# EAGLE design bbps5 (EAGLE 5.11)
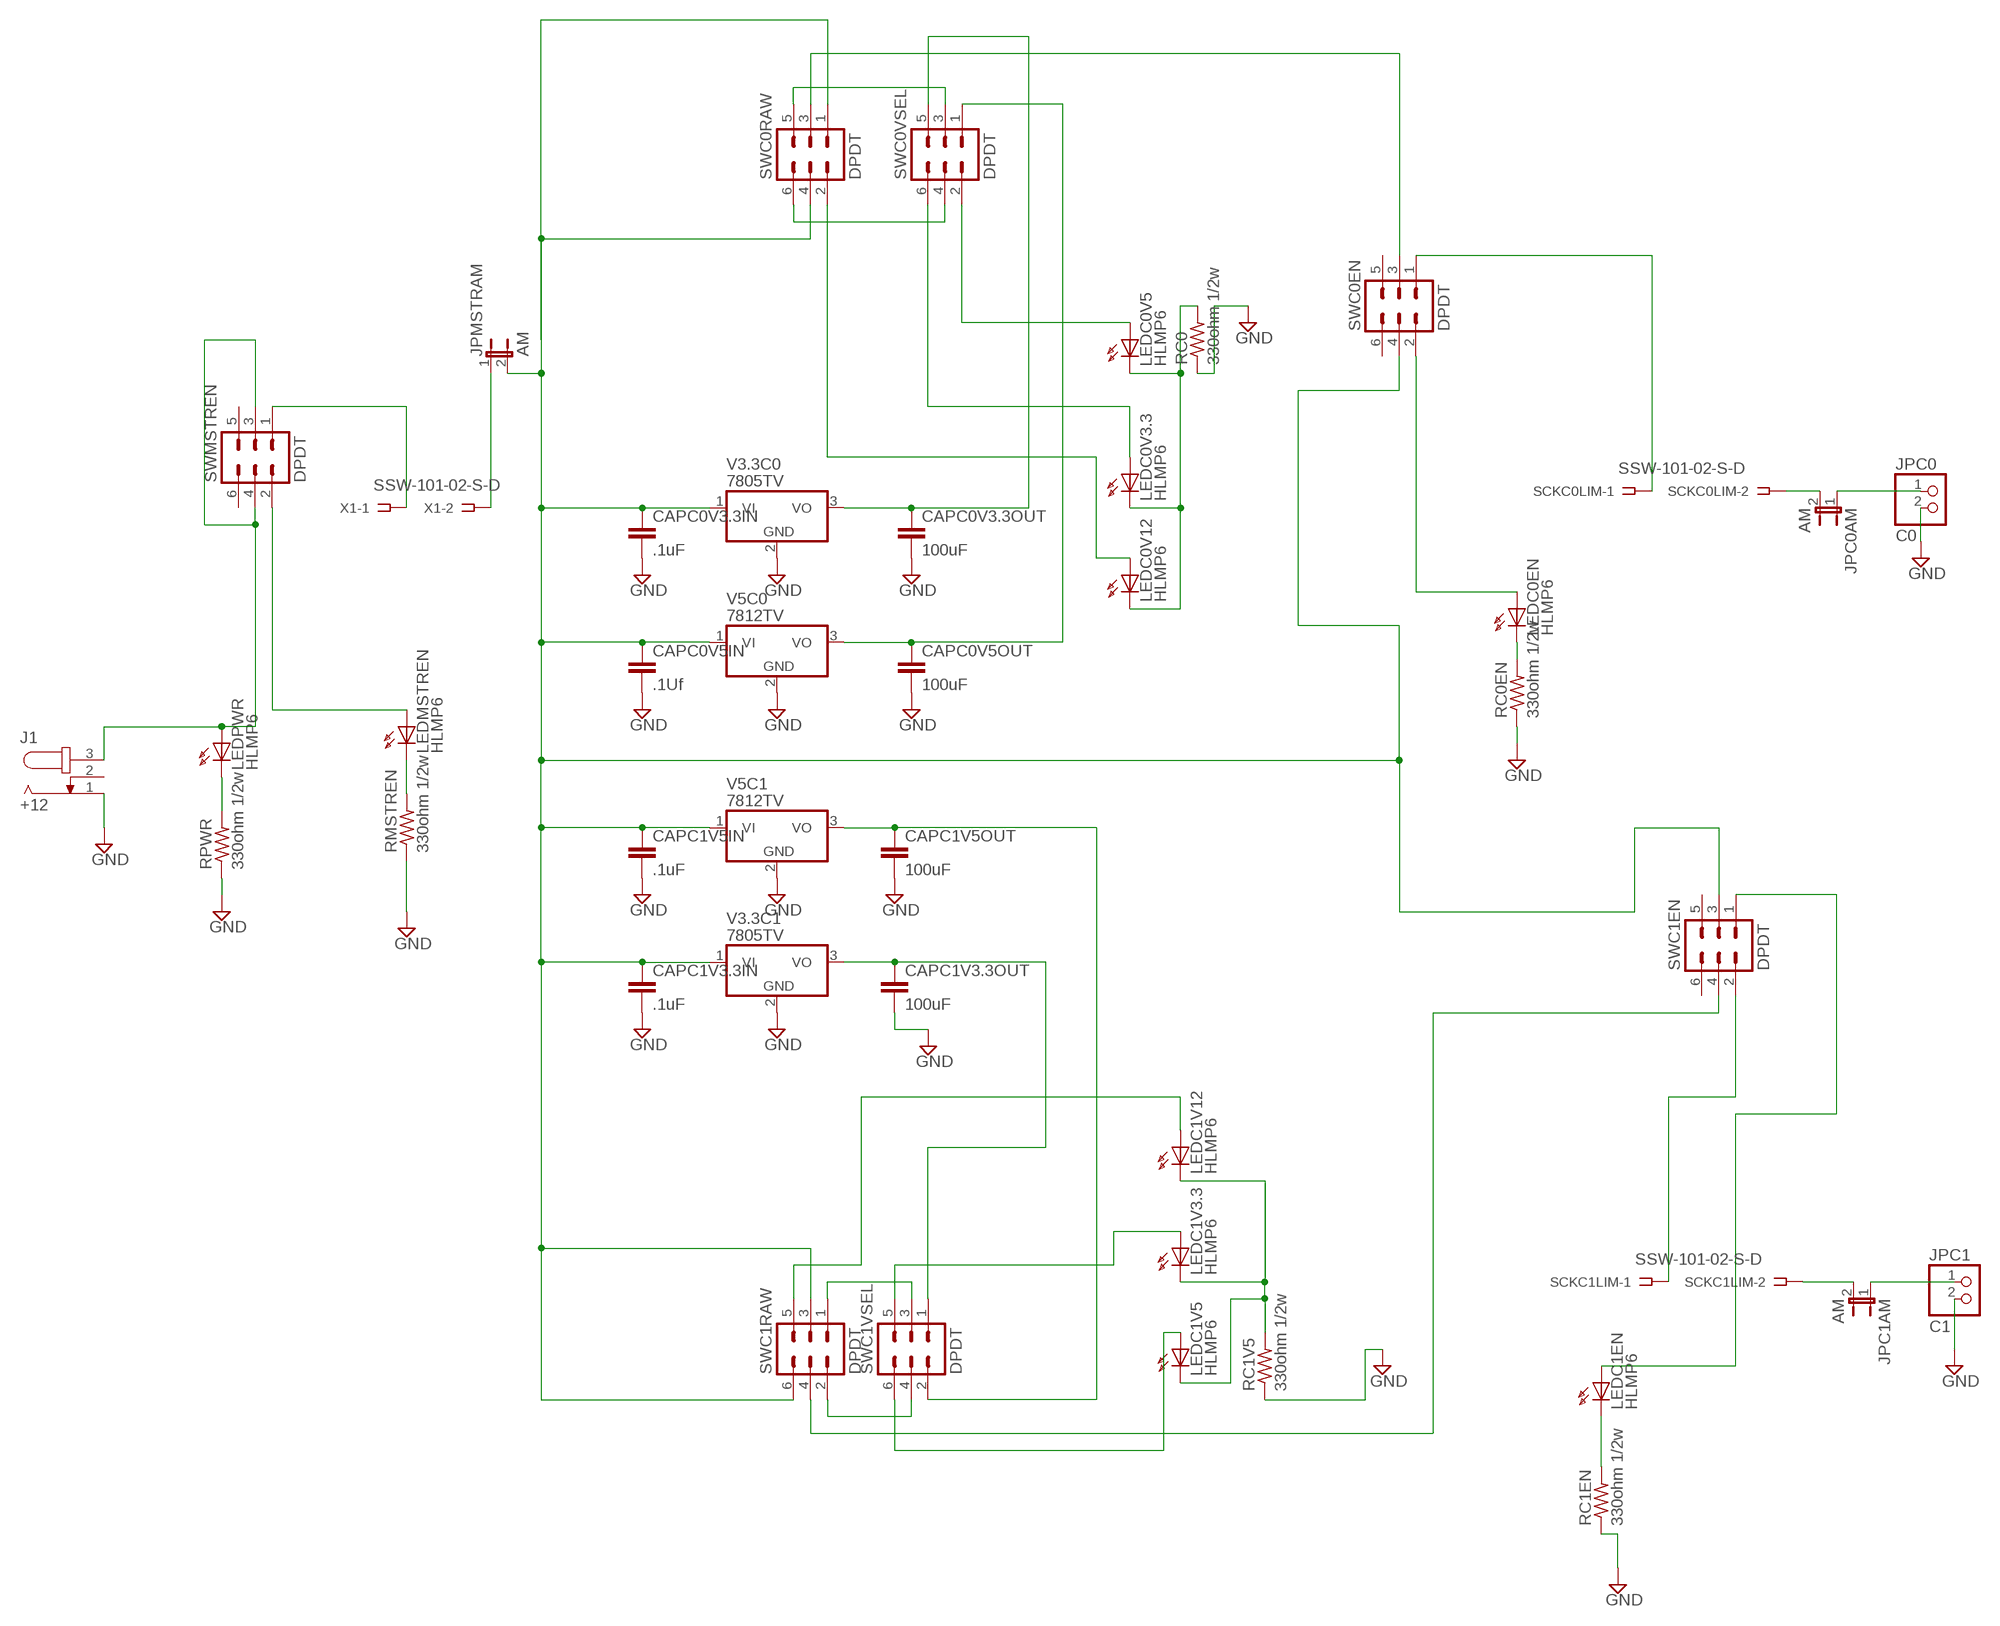
[diagram p0: schematic, sheet 1]

## Parts
CAPC0V3.3IN  .1uF  C5/7.2  [C5B7.2]
CAPC0V3.3OUT  100uF  C5/7.2  [C5B7.2]
CAPC0V5IN  .1Uf  C5/7.2  [C5B7.2]
CAPC0V5OUT  100uF  C5/7.2  [C5B7.2]
CAPC1V3.3IN  .1uF  C5/7.2  [C5B7.2]
CAPC1V3.3OUT  100uF  C5/7.2  [C5B7.2]
CAPC1V5IN  .1uF  C5/7.2  [C5B7.2]
CAPC1V5OUT  100uF  C5/7.2  [C5B7.2]
J1  +12  JACK-PLUG0  [SPC4077]
JPC0  C0  PINHD-1X2  [1X02]
JPC0AM  AM  JP1E  [JP1]
JPC1  C1  PINHD-1X2  [1X02]
JPC1AM  AM  JP1E  [JP1]
JPMSTRAM  AM  JP1E  [JP1]
LEDC0EN  HLMP6  [HLMP6]
LEDC0V3.3  HLMP6  [HLMP6]
LEDC0V5  HLMP6  [HLMP6]
LEDC0V12  HLMP6  [HLMP6]
LEDC1EN  HLMP6  [HLMP6]
LEDC1V3.3  HLMP6  [HLMP6]
LEDC1V5  HLMP6  [HLMP6]
LEDC1V12  HLMP6  [HLMP6]
LEDMSTREN  HLMP6  [HLMP6]
LEDPWR  HLMP6  [HLMP6]
RC0  330ohm 1/2w  R-US_0207/10  [0207/10]
RC0EN  330ohm 1/2w  R-US_0207/10  [0207/10]
RC1EN  330ohm 1/2w  R-US_0207/10  [0207/10]
RC1V5  330ohm 1/2w  R-US_0207/10  [0207/10]
RMSTREN  330ohm 1/2w  R-US_0207/10  [0207/10]
RPWR  330ohm 1/2w  R-US_0207/10  [0207/10]
SCKC0LIM  SSW-101-02-S-D  [SSW-101-02-S-D]
SCKC1LIM  SSW-101-02-S-D  [SSW-101-02-S-D]
SWC0EN  DPDT  MA03-2  [MA03-2]
SWC0RAW  DPDT  MA03-2  [MA03-2]
SWC0VSEL  DPDT  MA03-2  [MA03-2]
SWC1EN  DPDT  MA03-2  [MA03-2]
SWC1RAW  DPDT  MA03-2  [MA03-2]
SWC1VSEL  DPDT  MA03-2  [MA03-2]
SWMSTREN  DPDT  MA03-2  [MA03-2]
V3.3C0  7805TV  [TO220V]
V3.3C1  7805TV  [TO220V]
V5C0  7812TV  [TO220V]
V5C1  7812TV  [TO220V]
X1  SSW-101-02-S-D  [SSW-101-02-S-D]

## Nets
GND: CAPC0V3.3IN.2 CAPC0V3.3OUT.2 CAPC0V5IN.2 CAPC0V5OUT.2 CAPC1V3.3IN.2 CAPC1V3.3OUT.2 CAPC1V5IN.2 CAPC1V5OUT.2 J1.1 JPC0.2 JPC1.2 RC0.1 RC0EN.1 RC1EN.1 RC1V5.1 RMSTREN.1 RPWR.1 V3.3C0.2(GND) V3.3C1.2(GND) V5C0.2(GND) V5C1.2(GND)
MSTREN: J1.3 LEDPWR.A SWMSTREN.3 SWMSTREN.4
N$1: CAPC1V3.3OUT.1 SWC1VSEL.1 V3.3C1.3(VO)
N$2: LEDMSTREN.K RMSTREN.2
N$3: LEDMSTREN.A SWMSTREN.2
N$4: LEDC0V5.A SWC0VSEL.2
N$5: LEDC0V3.3.K LEDC0V5.K LEDC0V12.K RC0.2
N$6: JPMSTRAM.1 X1.2
N$7: LEDPWR.K RPWR.2
N$8: JPC0.1 JPC0AM.1
N$9: JPC1AM.2 SCKC1LIM.2
N$10: JPC0AM.2 SCKC0LIM.2
N$11: SCKC0LIM.1 SWC0EN.1
N$12: LEDC0EN.A SWC0EN.2
N$13: LEDC0EN.K RC0EN.2
N$14: LEDC0V12.A SWC0RAW.2
N$15: SWC0RAW.6 SWC0VSEL.4
N$16: SWC0RAW.5 SWC0VSEL.3
N$17: SWC0EN.3 SWC0RAW.3
N$18: LEDC0V3.3.A SWC0VSEL.6
N$19: LEDC1V3.3.K LEDC1V5.K LEDC1V12.K RC1V5.2
N$20: CAPC0V3.3OUT.1 SWC0VSEL.5 V3.3C0.3(VO)
N$21: CAPC0V5OUT.1 SWC0VSEL.1 V5C0.3(VO)
N$22: LEDC1V5.A SWC1VSEL.6
N$24: SWC1RAW.1 SWC1VSEL.3
N$25: SWC1RAW.2 SWC1VSEL.4
N$26: CAPC1V5OUT.1 SWC1VSEL.2 V5C1.3(VO)
N$27: JPC1.1 JPC1AM.1
N$28: LEDC1EN.K RC1EN.2
N$30: CAPC0V3.3IN.1 CAPC0V5IN.1 CAPC1V3.3IN.1 CAPC1V5IN.1 JPMSTRAM.2 SWC0EN.4 SWC0RAW.1 SWC0RAW.4 SWC1EN.3 SWC1RAW.3 SWC1RAW.6 V3.3C0.1(VI) V3.3C1.1(VI) V5C0.1(VI) V5C1.1(VI)
N$32: LEDC1V3.3.A SWC1VSEL.5
N$36: LEDC1EN.A SWC1EN.1
N$38: SCKC1LIM.1 SWC1EN.2
N$41: SWC1EN.4 SWC1RAW.4
SCKMSTRLIM: SWMSTREN.1 X1.1
SWC1VSEL: LEDC1V12.A SWC1RAW.5
Unconnected: J1.2 SWC0EN.5 SWC0EN.6 SWC1EN.5 SWC1EN.6 SWMSTREN.5 SWMSTREN.6

## Library data of the parts
CAPC0V3.3IN CAPC0V3.3OUT CAPC0V5IN CAPC0V5OUT CAPC1V3.3IN CAPC1V3.3OUT CAPC1V5IN CAPC1V5OUT = capacitor-wima:C: CAPACITOR naming: grid - package width
J1 = con-jack:JACK-PLUG: DC POWER JACK Power Jack, DC, Right Angle, Through Hole, Rated 5A at 16VDC, PC Terminals Distributor: Farnell (www.Farnell.de) Drawing: 84N1161.pdf / 84N1162.pdf Manufacturer: SPC Technology (www.spctechnology.com) Type: SPC4077 / SPC 4078; OC_FARNELL: unknown; OC_NEWARK: unknown
JPC0 JPC1 = pinhead:PINHD-1X2: PIN HEADER
JPC0AM JPC1AM JPMSTRAM = jumper:JP1E: JUMPER
LEDC0EN LEDC0V3.3 LEDC0V5 LEDC0V12 LEDC1EN LEDC1V3.3 LEDC1V5 LEDC1V12 LEDMSTREN LEDPWR = display-hp:HLMP6: LED 2mm horizontal; MF: AGILENT TECHNOLOGIES; MPN: HLMP-6500; OC_FARNELL: 1652490; OC_NEWARK: 40K0088
RC0 RC0EN RC1EN RC1V5 RMSTREN RPWR = resistor:R-US_: RESISTOR, American symbol
SCKC0LIM SCKC1LIM X1 = con-samtec:SSW-101-02-S-D: THROUGH-HOLE .025" SQ POST SOCKET Source: Samtec SSW.pdf; MPN: SSW-101-02-S-D; OC_FARNELL: unknown; OC_NEWARK: 82P1456
SWC0EN SWC0RAW SWC0VSEL SWC1EN SWC1RAW SWC1VSEL SWMSTREN = con-lstb:MA03-2: PIN HEADER; OC_FARNELL: unknown; OC_NEWARK: unknown
V3.3C0 V3.3C1 V5C0 V5C1 = linear:78*: Positive VOLTAGE REGULATOR Source: http://cache.national.com/ds/LM/LM78L05.pdf http://www.fairchildsemi.com/ds/LM/LM7805.pdf

## Board
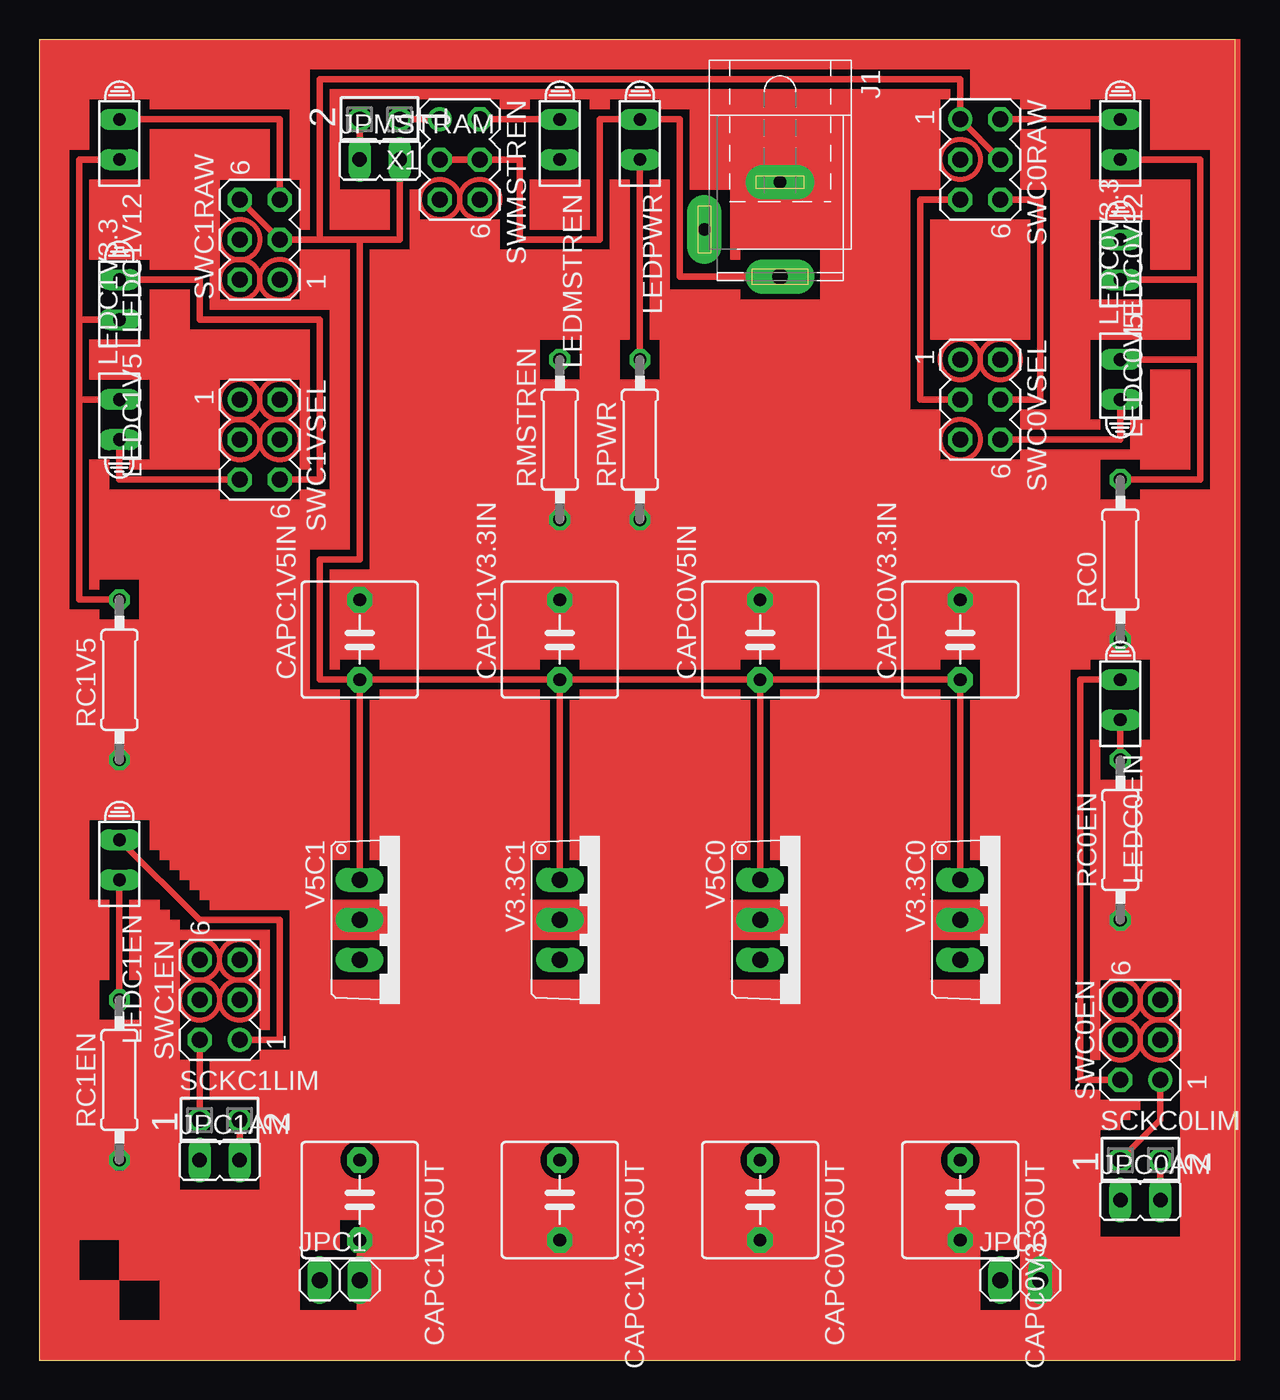
[diagram p1: board, top side]
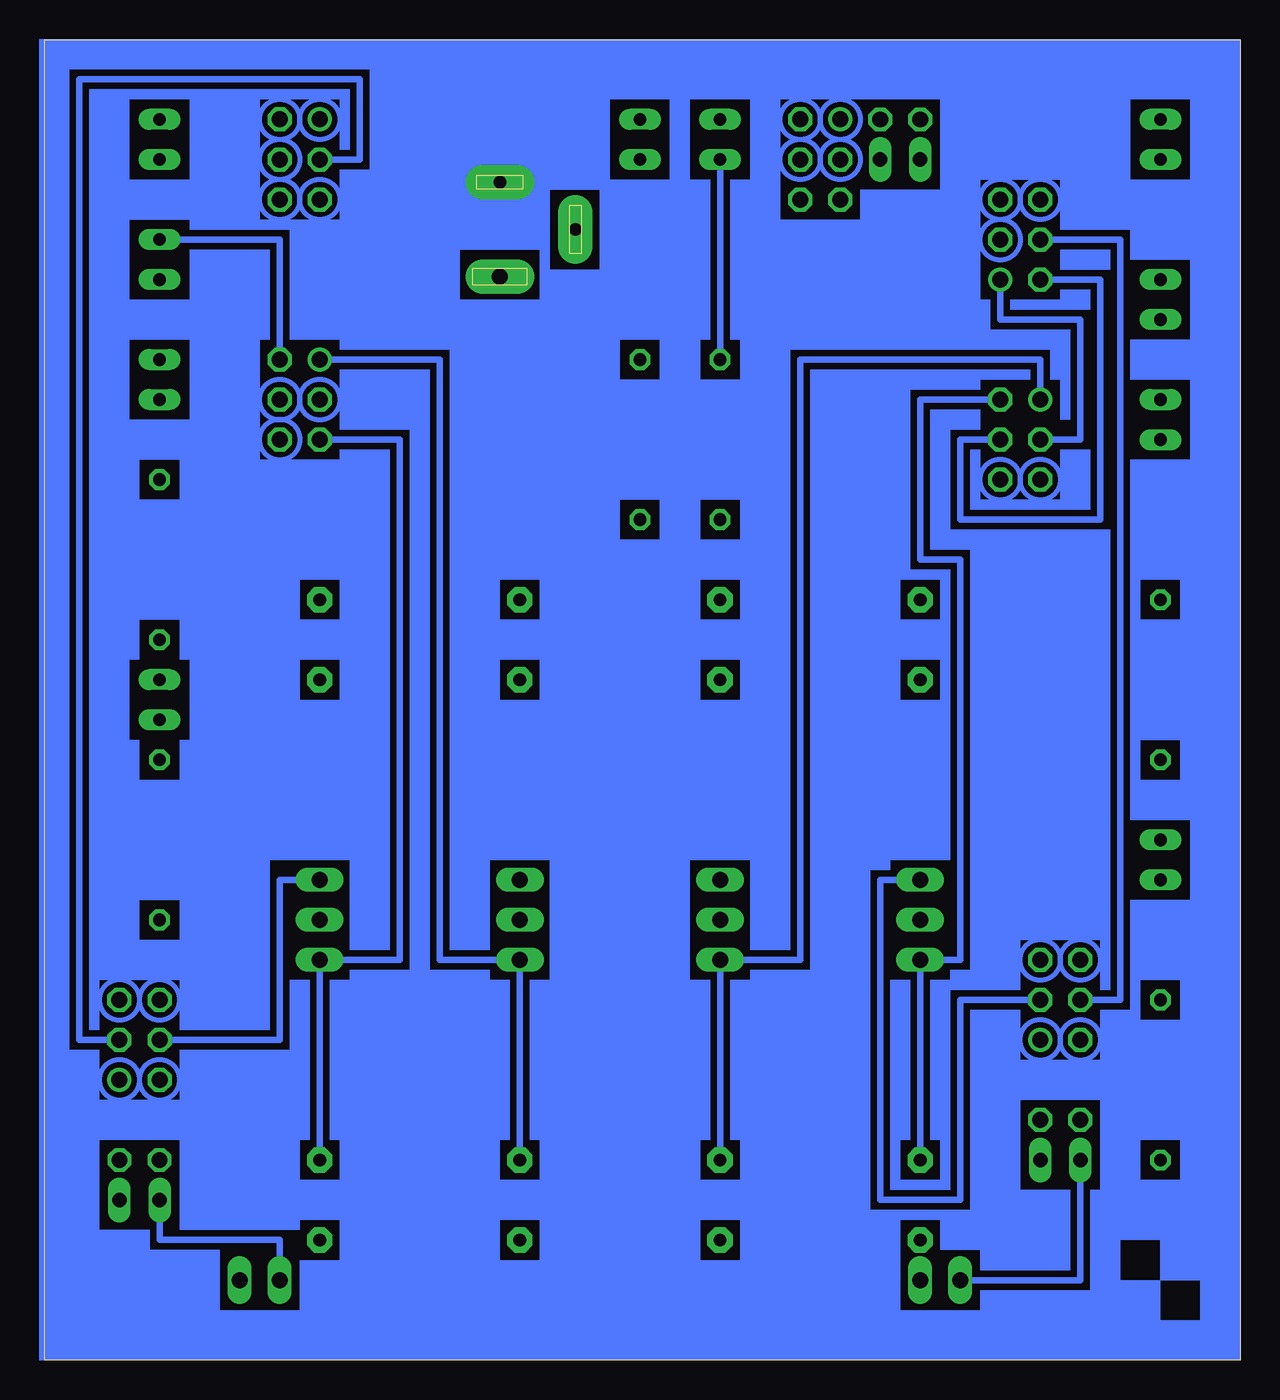
[diagram p2: board, bottom side, seen from below]

Size 75.87 x 83.81 mm. Coordinates in mm from the lower left corner, seen from the top.
Outline: 0,0 75.87,0 75.87,83.81 0,83.81 0,0
Copper layers (1*16): Top 0.035mm / dielectric 1.5mm / Bottom 0.035mm
Design rules "default": minimum track width 10mil, minimum drill 24mil, track to track 8mil, track to pad 8mil, pad to pad 8mil, via to via 8mil, smd to smd 8mil, copper to edge 40mil, drill to drill 8mil, minimum pad ring 10mil, minimum via ring 8mil, stop-mask expansion 4mil, vias tented up to drill 0mil, thermal gap 10mil

### Footprints (pad centres in the part's own frame; a part is rotated, then mirrored left to right if it is on the bottom)
C5B7.2 = drill 0.813 pad 1.6 octagon: 1 -2.54,0; 2 2.54,0
SPC4077 = drill 0.8 pad 2.184 long: 1 -3,0; 2 0,-4.8 | drill 1 pad 2.184 long: 3 3,0
1X02 = drill 1.016 long: 1 -1.27,0; 2 1.27,0
JP1 = drill 0.914 long: 1 0,-1.27; 2 0,1.27
HLMP6 = drill 0.813 long: A -1.27,0; K 1.27,0
0207/10 = drill 0.813 octagon: 1 -5.08,0; 2 5.08,0
SSW-101-02-S-D = drill 1 pad 1.5 octagon: 1 0,-1.27; 2 0,1.27
MA03-2 = drill 1.016 round: 1 -2.54,-1.27 | drill 1.016 octagon: 2 -2.54,1.27; 3 0,-1.27; 4 0,1.27; 5 2.54,-1.27; 6 2.54,1.27
TO220V = drill 1.016 long: 1 -2.54,-2.54; 2 0,-2.54; 3 2.54,-2.54

### Placement (x,y rotation side)
CAPC0V3.3IN  58.42,45.72 90 top
CAPC0V3.3OUT  58.42,10.16 270 top
CAPC0V5IN  45.72,45.72 90 top
CAPC0V5OUT  45.72,10.16 270 top
CAPC1V3.3IN  33.02,45.72 90 top
CAPC1V3.3OUT  33.02,10.16 270 top
CAPC1V5IN  20.32,45.72 90 top
CAPC1V5OUT  20.32,10.16 270 top
J1  46.99,71.75 270 top
JPC0  62.23,5.08 0 top
JPC0AM  69.85,10.16 270 top
JPC1  19.05,5.08 0 top
JPC1AM  11.43,12.7 270 top
JPMSTRAM  21.59,76.2 270 top
LEDC0EN  68.58,41.91 270 top
LEDC0V3.3  68.58,62.23 90 top
LEDC0V5  68.58,69.85 270 top
LEDC0V12  68.58,77.47 270 top
LEDC1EN  5.08,31.75 270 top
LEDC1V3.3  5.08,59.69 90 top
LEDC1V5  5.08,67.31 270 top
LEDC1V12  5.08,77.47 270 top
LEDMSTREN  33.02,77.47 270 top
LEDPWR  38.1,77.47 270 top
RC0  68.58,50.8 90 top
RC0EN  68.58,33.02 90 top
RC1EN  5.08,17.78 90 top
RC1V5  5.08,43.18 90 top
RMSTREN  33.02,58.42 90 top
RPWR  38.1,58.42 90 top
SCKC0LIM  69.85,12.7 270 top
SCKC1LIM  11.43,15.24 270 top
SWC0EN  69.85,20.32 90 top
SWC0RAW  59.69,76.2 270 top
SWC0VSEL  59.69,60.96 270 top
SWC1EN  11.43,22.86 90 top
SWC1RAW  13.97,71.12 90 top
SWC1VSEL  13.97,58.42 270 top
SWMSTREN  26.67,76.2 270 top
V3.3C0  60.96,27.94 270 top
V3.3C1  35.56,27.94 270 top
V5C0  48.26,27.94 270 top
V5C1  22.86,27.94 270 top
X1  21.59,78.74 90 top

### Tracks (layer width: path | path; a pad name or v marks a point on that pad's centre or on a via)
GND
  Top 0.406: J1.1 53.34,74.75 53.34,66.04 45.72,66.04 45.72,53.34 | CAPC0V5IN.2 45.72,53.34 | CAPC0V5IN.2 CAPC1V3.3IN.2 CAPC1V5IN.2 | 63.5,7.62 CAPC0V3.3OUT.2 CAPC0V5OUT.2 CAPC1V3.3OUT.2 CAPC1V5OUT.2 JPC1.2 20.32,2.54 15.24,2.54 RC1EN.1 | RPWR.1 RMSTREN.1 45.72,53.34 | CAPC0V5IN.2 CAPC0V3.3IN.2 63.5,48.26 63.5,27.94 | 63.5,27.94 V3.3C0.2 V5C0.2 V3.3C1.2 V5C1.2 17.78,27.94 15.24,30.48 12.7,30.48 RC1V5.1 | 63.5,7.62 JPC0.2 | 63.5,7.62 63.5,27.94 | 63.5,7.62 73.66,7.62 73.66,27.94 | RC0.1 73.66,45.72 73.66,27.94 | 73.66,27.94 RC0EN.1
MSTREN
  Top 0.406: J1.3 40.64,68.75 40.64,78.74 LEDPWR.A 35.56,78.74 35.56,71.12 30.48,71.12 30.48,76.2 SWMSTREN.4 SWMSTREN.3
N$1
  Bottom 0.406: CAPC1V3.3OUT.1 V3.3C1.3 27.94,25.4 27.94,63.5 12.7,63.5 SWC1VSEL.1
N$2
  Bottom 0.406: RMSTREN.2 LEDMSTREN.K
N$3
  Top 0.406: SWMSTREN.2 LEDMSTREN.A
N$4
  Bottom 0.406: SWC0VSEL.2 60.96,71.12 LEDC0V5.A
N$5
  Top 0.406: LEDC0V12.K 73.66,76.2 73.66,68.58 | 73.66,68.58 LEDC0V5.K | 73.66,63.5 73.66,68.58 | 73.66,63.5 LEDC0V3.3.K | 73.66,63.5 73.66,55.88 RC0.2
N$6
  Top 0.406: JPMSTRAM.1 X1.2
N$7
  Top 0.406: RPWR.2 LEDPWR.K
N$8
  Bottom 0.406: JPC0AM.1 68.58,7.62 60.96,7.62 JPC0.1
N$9
  Top 0.406: JPC1AM.2 SCKC1LIM.2
N$10
  Top 0.406: JPC0AM.2 SCKC0LIM.2
N$11
  Top 0.406: SCKC0LIM.1 71.12,15.24 SWC0EN.1
N$12
  Top 0.406: LEDC0EN.A 66.04,43.18 66.04,17.78 SWC0EN.2
N$13
  Top 0.406: RC0EN.2 LEDC0EN.K
N$14
  Top 0.406: SWC0RAW.2 LEDC0V12.A
N$15
  Top 0.406: SWC0RAW.6 63.5,73.66 63.5,60.96 SWC0VSEL.4
N$16
  Top 0.406: SWC0RAW.5 55.88,73.66 55.88,60.96 SWC0VSEL.3
N$17
  Bottom 0.406: SWC0RAW.3 55.88,76.2 55.88,81.28 73.66,81.28 73.66,20.32 SWC0EN.3
N$18
  Top 0.406: SWC0VSEL.6 68.58,58.42 LEDC0V3.3.A
N$19
  Top 0.406: LEDC1V12.K 2.54,76.2 2.54,66.04 | 2.54,60.96 LEDC1V3.3.K | 2.54,60.96 2.54,48.26 RC1V5.2 | 2.54,66.04 LEDC1V5.K | 2.54,60.96 2.54,66.04
N$20
  Bottom 0.406: CAPC0V3.3OUT.1 V3.3C0.3 53.34,25.4 53.34,58.42 SWC0VSEL.5
N$21
  Bottom 0.406: CAPC0V5OUT.1 V5C0.3 50.8,25.4 50.8,63.5 SWC0VSEL.1
N$22
  Top 0.406: LEDC1V5.A 10.16,68.58 10.16,66.04 17.78,66.04 17.78,55.88 SWC1VSEL.6
N$24
  Bottom 0.406: SWC1VSEL.3 10.16,58.42 10.16,66.04 15.24,66.04 SWC1RAW.1
N$25
  Bottom 0.406: SWC1RAW.2 8.89,68.58 8.89,53.34 17.78,53.34 17.78,58.42 SWC1VSEL.4
N$26
  Bottom 0.406: CAPC1V5OUT.1 V5C1.3 17.78,25.4 17.78,50.8 20.32,50.8 20.32,60.96 SWC1VSEL.2
N$27
  Bottom 0.406: JPC1AM.1 10.16,5.08 JPC1.1
N$28
  Top 0.406: RC1EN.2 LEDC1EN.K
N$30
  Top 0.406: 20.32,71.12 22.86,71.12 JPMSTRAM.2 | CAPC1V5IN.1 17.78,43.18 17.78,50.8 20.32,50.8 20.32,71.12 | CAPC1V5IN.1 CAPC1V3.3IN.1 | CAPC1V3.3IN.1 CAPC0V5IN.1 | CAPC0V5IN.1 CAPC0V3.3IN.1 V3.3C0.1 | V5C1.1 CAPC1V5IN.1 | CAPC1V3.3IN.1 V3.3C1.1 | CAPC0V5IN.1 V5C0.1 | 20.32,71.12 17.78,71.12 | 17.78,71.12 SWC1RAW.3 SWC1RAW.6 | 17.78,71.12 17.78,81.28 58.42,81.28 SWC0RAW.1 SWC0RAW.4
  Bottom 0.406: V5C1.1 22.86,30.48 22.86,10.16 17.78,10.16 17.78,22.86 SWC1EN.3 | V3.3C0.1 60.96,30.48 60.96,20.32 SWC0EN.4
N$32
  Top 0.406: SWC1VSEL.5 5.08,55.88 LEDC1V3.3.A
  Bottom 0.406: LEDC1V3.3.A 5.23,58.42
N$36
  Top 0.406: LEDC1EN.A 10.16,27.94 15.24,27.94 15.24,20.32 SWC1EN.1
N$38
  Top 0.406: SCKC1LIM.1 SWC1EN.2
N$41
  Bottom 0.406: SWC1RAW.4 7.62,71.12 7.62,22.86 SWC1EN.4
SCKMSTRLIM
  Top 0.406: X1.1 SWMSTREN.1
SWC1VSEL
  Top 0.406: LEDC1V12.A 15.24,78.74 SWC1RAW.5
(copper drawn outside any net)
  shapes: Bottom area x258, Bottom circle x25, Top area x298, Top circle x30